# Altium schematic sheet XL-1005SURC_C255033451_XL-1005SURC_C25503345.schdoc
size 127 x 101 mm
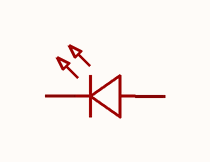
[diagram p0: XL-1005SURC_C255033451_XL-1005SURC_C25503345.schdoc]

## Parts
U?  XL-1005SURC  [LED0402-RD]  (value not drawn)

## Nets

Not connected (* = marked no-connect by the designer): U? 1(K) 2(A)

## Library data of the parts
U? = XL-1005SURC_C25503345: Manufacturer: XINGLIGHT(成兴光); Add into BOM: yes; Illumination Color: 红色; Voltage - Forward(Vf): 1.8V~2.4V; Power(Watts): 50mW; Forward Current: 20mA; Wavelength - Dominant: 615nm~630nm; Peak Wavelength: 625nm; Luminous Intensity: 200mcd; Viewing Angle: 120°; Symbol: XL-1005SURC_C25503345; Device: XL-1005SURC_C25503345; LCSC Part Name: 0402分光红贴片式发光二极管; Supplier Part: C25503345; Manufacturer Part: XL-1005SURC; Supplier Footprint: 0402; JLCPCB Part Class: Extended Part; Datasheet: https://item.szlcsc.com/datasheet/XL-1005SURC/27234956.html; Supplier: LCSC; Convert to PCB: yes; Operating Temperature: -40℃~+85℃